# Altium schematic sheet LightLink_V3.SchDoc
size C; SheetNumber: 1; SheetTotal: 7
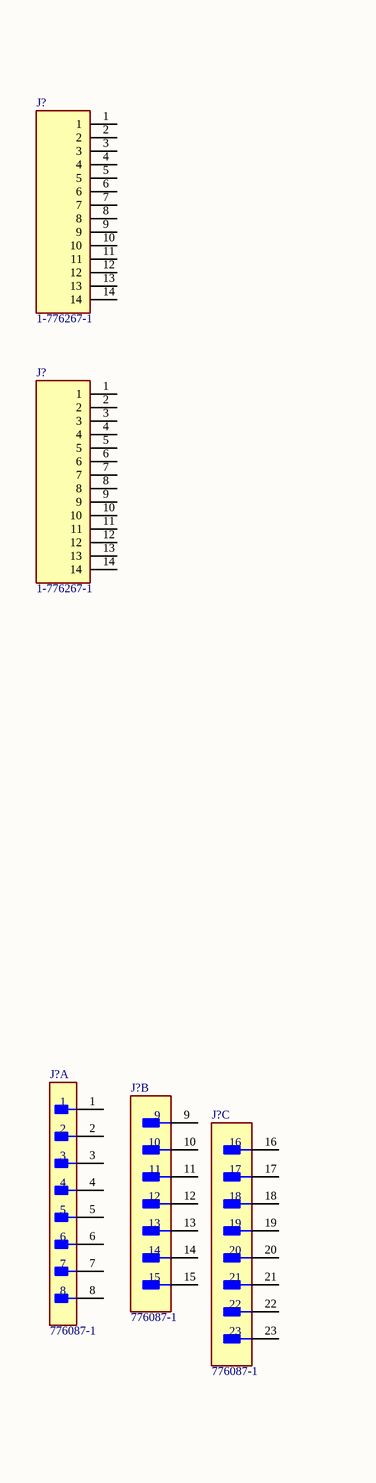
[diagram p0: LightLink_V3.SchDoc, left]
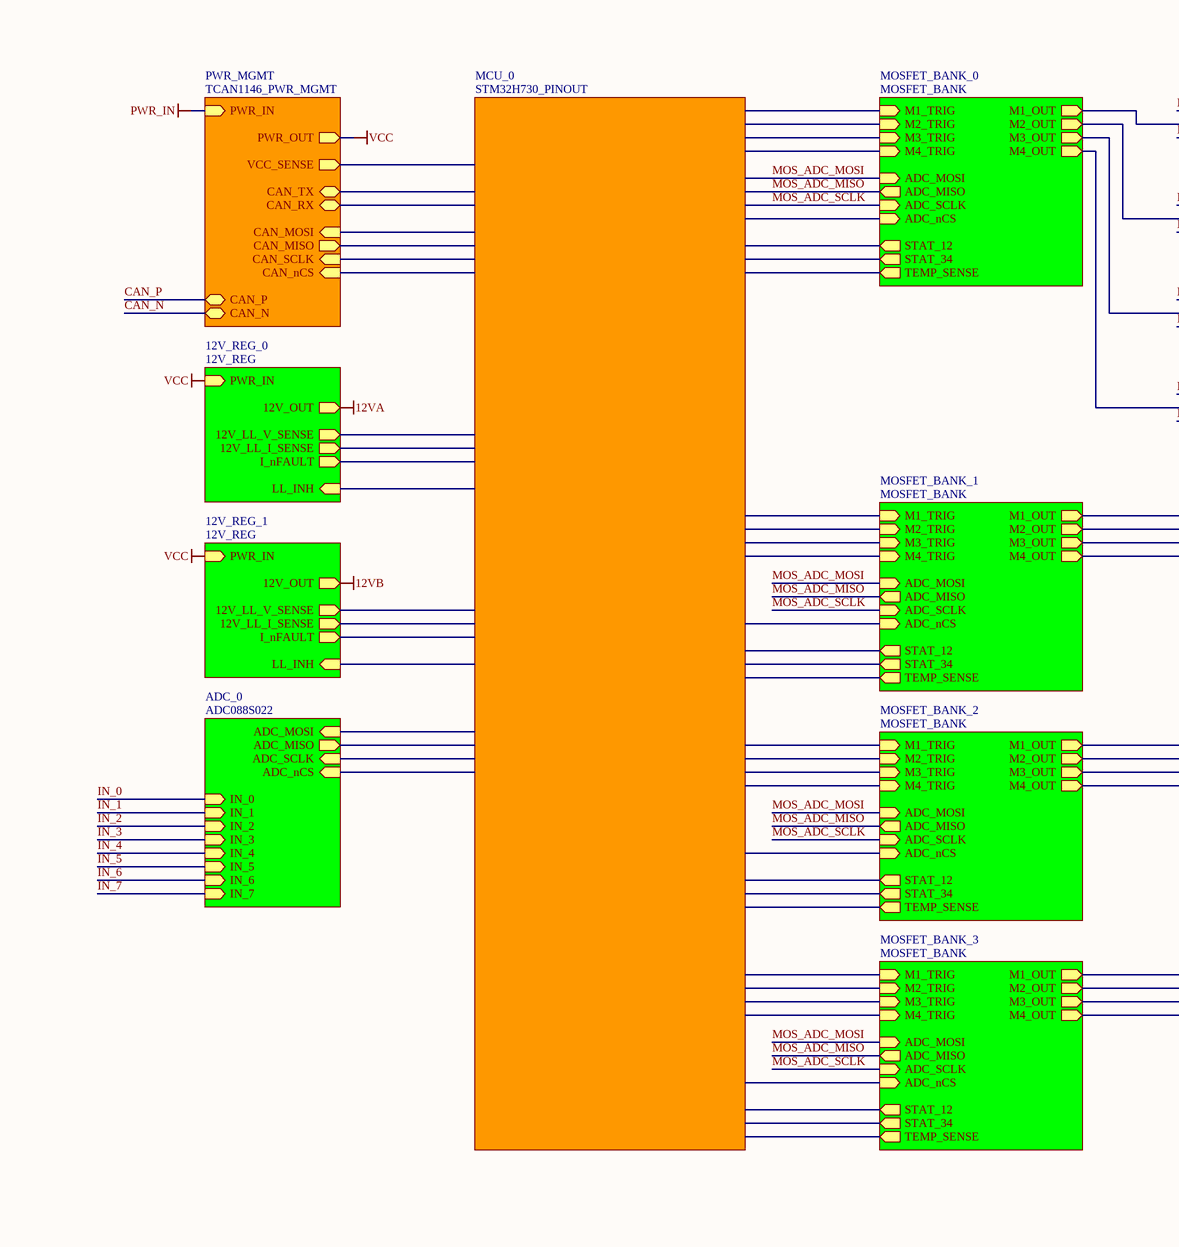
[diagram p1: LightLink_V3.SchDoc, middle]
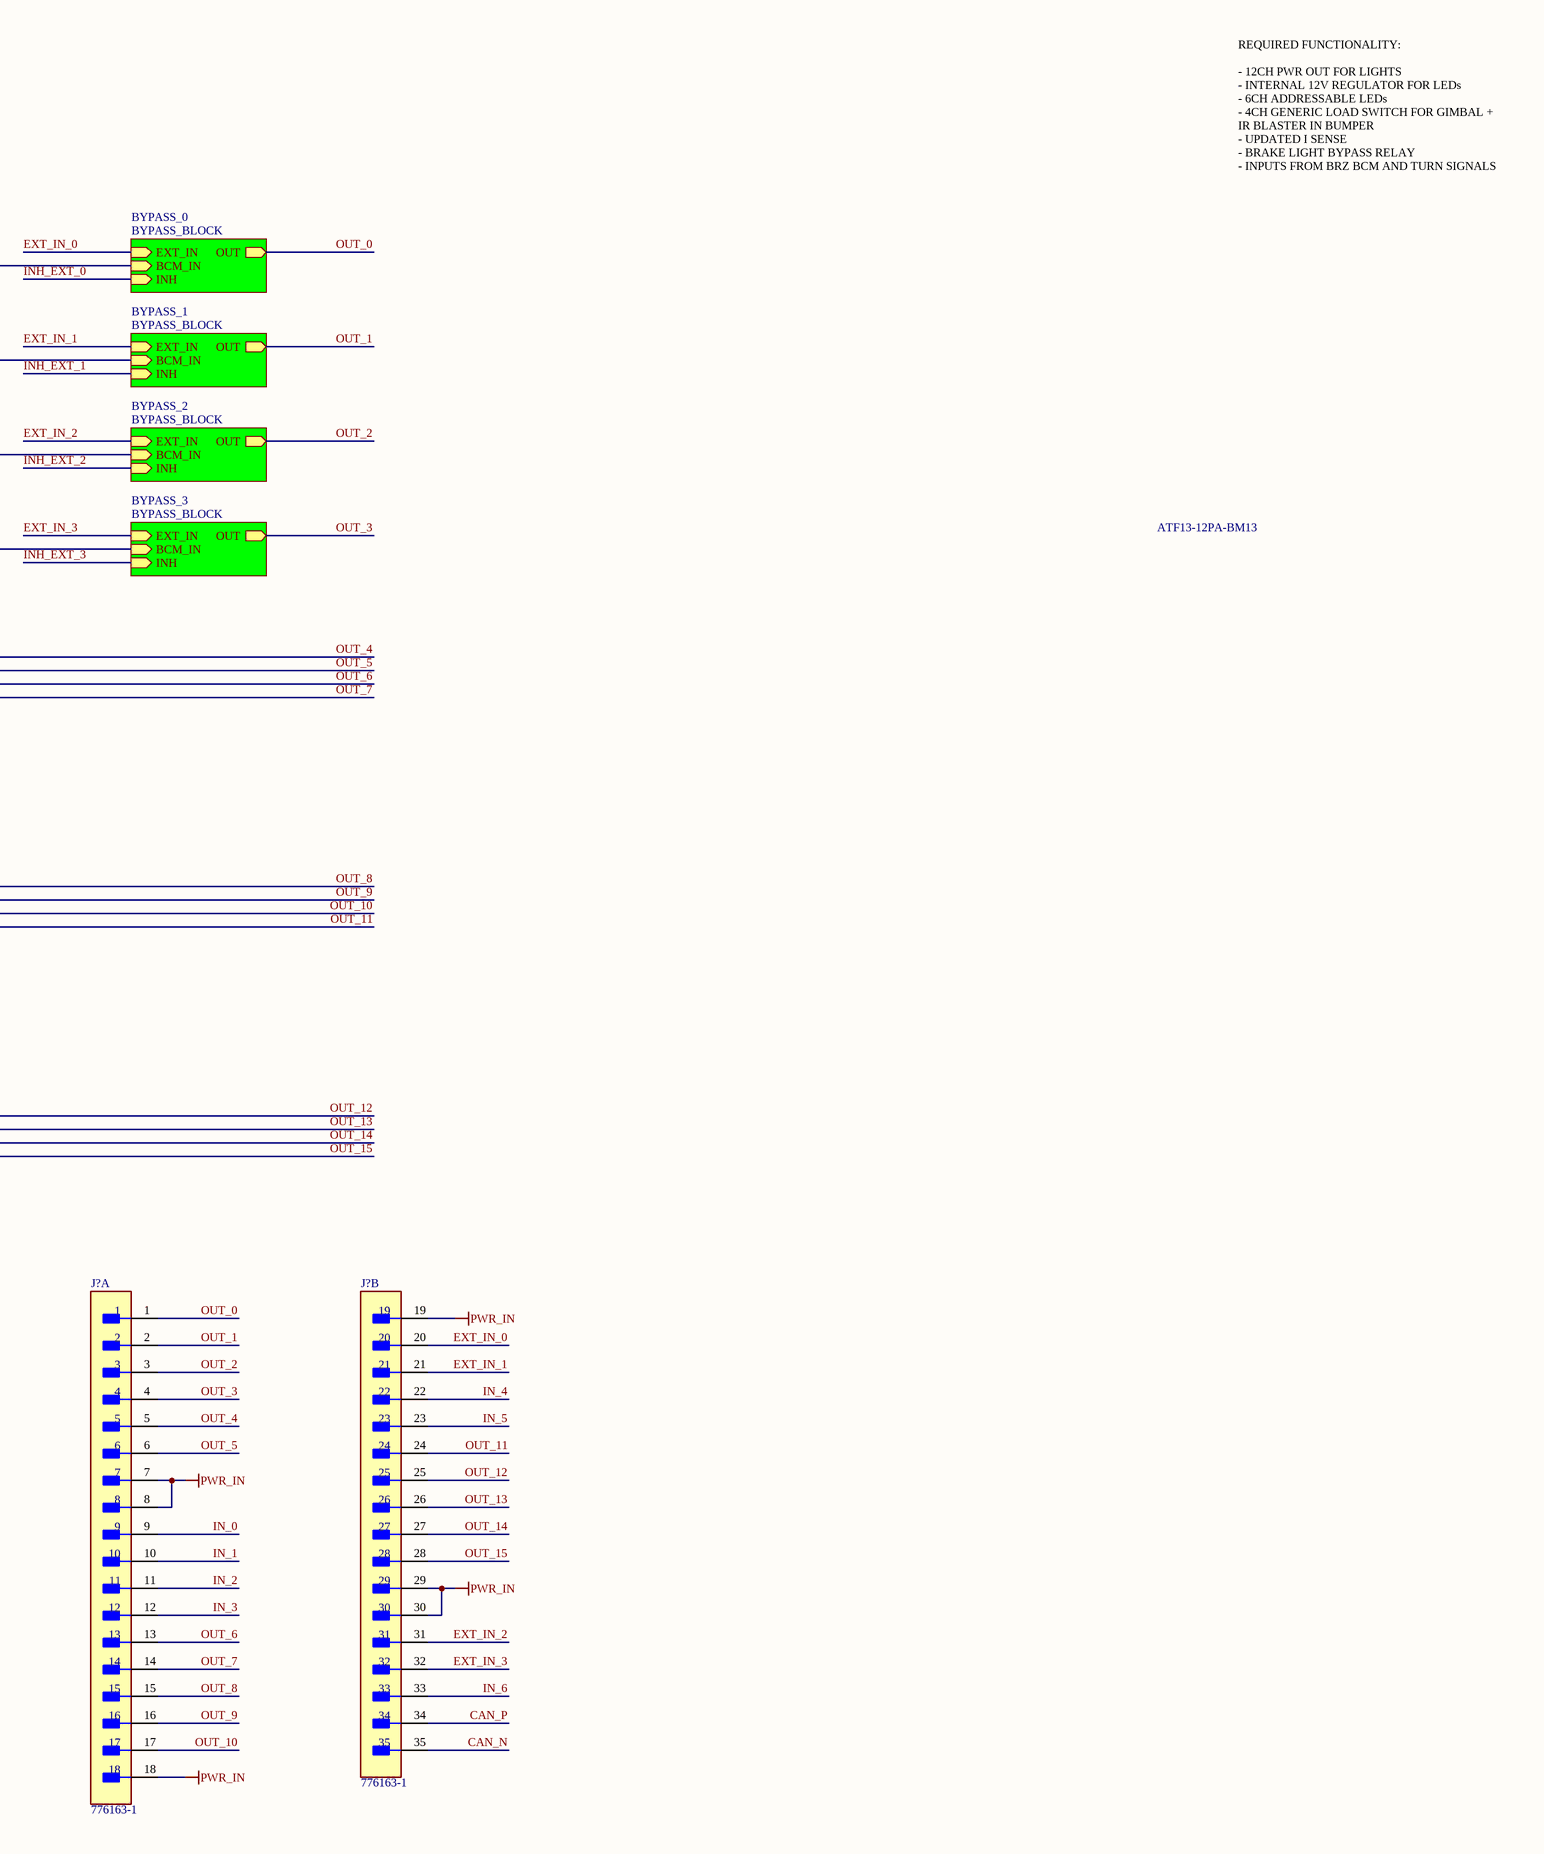
[diagram p2: LightLink_V3.SchDoc, right]

## Parts
(Parts that share a designator on the sheet are numbered #1, #2 ... from top to bottom, then left to right.)
J?#1  1-776267-1  [1-776267-2-Footprint-1]
J?#2  1-776267-1  [1-776267-2-Footprint-1]
J?#3  776163-1  [FP-776163-1-MFG]  (part A of 2)
J?#4  776163-1  [FP-776163-1-MFG]  (part B of 2)
J?#5  776087-1  [FP-776087-1-MFG]  (part A of 3)
J?#6  776087-1  [FP-776087-1-MFG]  (part B of 3)
J?#7  776087-1  [FP-776087-1-MFG]  (part C of 3)

## Sub-sheets
12V_REG_0 = 12V_REG: PWR_IN (in), LL_INH (in), 12V_OUT (out), 12V_LL_V_SENSE (out), 12V_LL_I_SENSE (out), I_nFAULT (out)
12V_REG_1 = 12V_REG: PWR_IN (in), LL_INH (in), 12V_OUT (out), 12V_LL_V_SENSE (out), 12V_LL_I_SENSE (out), I_nFAULT (out)
ADC_0 = ADC088S022: IN_0 (in), IN_1 (in), IN_2 (in), IN_3 (in), IN_4 (in), IN_5 (in), IN_6 (in), IN_7 (in), ADC_MOSI (in), ADC_MISO (out), ADC_SCLK (in), ADC_nCS (in)
BYPASS_0 = BYPASS_BLOCK: EXT_IN (in), OUT (out), INH (in), BCM_IN (in)
BYPASS_1 = BYPASS_BLOCK: EXT_IN (in), OUT (out), INH (in), BCM_IN (in)
BYPASS_2 = BYPASS_BLOCK: EXT_IN (in), OUT (out), INH (in), BCM_IN (in)
BYPASS_3 = BYPASS_BLOCK: EXT_IN (in), OUT (out), INH (in), BCM_IN (in)
MCU_0 = STM32H730_PINOUT: no entries
MOSFET_BANK_0 = MOSFET_BANK: M1_OUT (out), M2_OUT (out), M3_OUT (out), M4_OUT (out), M1_TRIG (in), M2_TRIG (in), M3_TRIG (in), M4_TRIG (in), STAT_12 (out), STAT_34 (out), ADC_MOSI (in), ADC_MISO (out), ADC_SCLK (in), ADC_nCS (in), TEMP_SENSE (out)
MOSFET_BANK_1 = MOSFET_BANK: M1_OUT (out), M2_OUT (out), M3_OUT (out), M4_OUT (out), M1_TRIG (in), M2_TRIG (in), M3_TRIG (in), M4_TRIG (in), STAT_12 (out), STAT_34 (out), ADC_MOSI (in), ADC_MISO (out), ADC_SCLK (in), ADC_nCS (in), TEMP_SENSE (out)
MOSFET_BANK_2 = MOSFET_BANK: M1_OUT (out), M2_OUT (out), M3_OUT (out), M4_OUT (out), M1_TRIG (in), M2_TRIG (in), M3_TRIG (in), M4_TRIG (in), STAT_12 (out), STAT_34 (out), ADC_MOSI (in), ADC_MISO (out), ADC_SCLK (in), ADC_nCS (in), TEMP_SENSE (out)
MOSFET_BANK_3 = MOSFET_BANK: M1_OUT (out), M2_OUT (out), M3_OUT (out), M4_OUT (out), M1_TRIG (in), M2_TRIG (in), M3_TRIG (in), M4_TRIG (in), STAT_12 (out), STAT_34 (out), ADC_MOSI (in), ADC_MISO (out), ADC_SCLK (in), ADC_nCS (in), TEMP_SENSE (out)
PWR_MGMT = TCAN1146_PWR_MGMT: PWR_IN (in), PWR_OUT (out), VCC_SENSE (out), CAN_TX (bidir), CAN_RX (bidir), CAN_SCLK (in), CAN_MISO (out), CAN_MOSI (in), CAN_nCS (in), CAN_P (bidir), CAN_N (bidir)

## Nets
12VA: sheet 12V_REG_0/12V_OUT
12VB: sheet 12V_REG_1/12V_OUT
PWR_IN: J?#3.7 J?#3.8 J?#3.18 J?#4.19 J?#4.29 J?#4.30 ; sheet PWR_MGMT/PWR_IN
VCC: sheet PWR_MGMT/PWR_OUT, sheet 12V_REG_0/PWR_IN, sheet 12V_REG_1/PWR_IN
CAN_N: J?#4.35 ; sheet PWR_MGMT/CAN_N
CAN_P: J?#4.34 ; sheet PWR_MGMT/CAN_P
EXT_IN_0: J?#4.20 ; sheet BYPASS_0/EXT_IN
EXT_IN_1: J?#4.21 ; sheet BYPASS_1/EXT_IN
EXT_IN_2: J?#4.31 ; sheet BYPASS_2/EXT_IN
EXT_IN_3: J?#4.32 ; sheet BYPASS_3/EXT_IN
IN_0: J?#3.9 ; sheet ADC_0/IN_0
IN_1: J?#3.10 ; sheet ADC_0/IN_1
IN_2: J?#3.11 ; sheet ADC_0/IN_2
IN_3: J?#3.12 ; sheet ADC_0/IN_3
IN_4: J?#4.22 ; sheet ADC_0/IN_4
IN_5: J?#4.23 ; sheet ADC_0/IN_5
IN_6: J?#4.33 ; sheet ADC_0/IN_6
IN_7: sheet ADC_0/IN_7
INH_EXT_0: sheet BYPASS_0/INH
INH_EXT_1: sheet BYPASS_1/INH
INH_EXT_2: sheet BYPASS_2/INH
INH_EXT_3: sheet BYPASS_3/INH
MOS_ADC_MISO: sheet MOSFET_BANK_0/ADC_MISO, sheet MOSFET_BANK_1/ADC_MISO, sheet MOSFET_BANK_2/ADC_MISO, sheet MOSFET_BANK_3/ADC_MISO
MOS_ADC_MOSI: sheet MOSFET_BANK_0/ADC_MOSI, sheet MOSFET_BANK_1/ADC_MOSI, sheet MOSFET_BANK_2/ADC_MOSI, sheet MOSFET_BANK_3/ADC_MOSI
MOS_ADC_SCLK: sheet MOSFET_BANK_0/ADC_SCLK, sheet MOSFET_BANK_1/ADC_SCLK, sheet MOSFET_BANK_2/ADC_SCLK, sheet MOSFET_BANK_3/ADC_SCLK
OUT_0: J?#3.1 ; sheet BYPASS_0/OUT
OUT_1: J?#3.2 ; sheet BYPASS_1/OUT
OUT_2: J?#3.3 ; sheet BYPASS_2/OUT
OUT_3: J?#3.4 ; sheet BYPASS_3/OUT
OUT_4: J?#3.5 ; sheet MOSFET_BANK_1/M1_OUT
OUT_5: J?#3.6 ; sheet MOSFET_BANK_1/M2_OUT
OUT_6: J?#3.13 ; sheet MOSFET_BANK_1/M3_OUT
OUT_7: J?#3.14 ; sheet MOSFET_BANK_1/M4_OUT
OUT_8: J?#3.15 ; sheet MOSFET_BANK_2/M1_OUT
OUT_9: J?#3.16 ; sheet MOSFET_BANK_2/M2_OUT
OUT_10: J?#3.17 ; sheet MOSFET_BANK_2/M3_OUT
OUT_11: J?#4.24 ; sheet MOSFET_BANK_2/M4_OUT
OUT_12: J?#4.25 ; sheet MOSFET_BANK_3/M1_OUT
OUT_13: J?#4.26 ; sheet MOSFET_BANK_3/M2_OUT
OUT_14: J?#4.27 ; sheet MOSFET_BANK_3/M3_OUT
OUT_15: J?#4.28 ; sheet MOSFET_BANK_3/M4_OUT
(unnamed): sheet MOSFET_BANK_0/M1_OUT, sheet BYPASS_0/BCM_IN
(unnamed): sheet MOSFET_BANK_0/M2_OUT, sheet BYPASS_1/BCM_IN
(unnamed): sheet MOSFET_BANK_0/M3_OUT, sheet BYPASS_2/BCM_IN
(unnamed): sheet MOSFET_BANK_0/M4_OUT, sheet BYPASS_3/BCM_IN

Not connected (* = marked no-connect by the designer): J?#1 1 2 3 4 5 6 7 8 9 10 11 12 13 14; J?#2 1 2 3 4 5 6 7 8 9 10 11 12 13 14; J?#5 1 2 3 4 5 6 7 8; J?#6 9 10 11 12 13 14 15; J?#7 16 17 18 19 20 21 22 23

## Notes on the sheet
- REQUIRED FUNCTIONALITY:
  - 12CH PWR OUT FOR LIGHTS
  - INTERNAL 12V REGULATOR FOR LEDs
  - 6CH ADDRESSABLE LEDs
  - 4CH GENERIC LOAD SWITCH FOR GIMBAL + IR BLASTER IN BUMPER
  - UPDATED I SENSE
  - BRAKE LIGHT BYPASS RELAY
  - INPUTS FROM BRZ BCM AND TURN SIGNALS
- ATF13-12PA-BM13

## Library data of the parts
J?#1 J?#2 = CMP-002-00075-1: Combination Line Connector, 14 Contact(s), Male, Solder Terminal - MODEL IS CODE2 BUT USE CODE1; RoHS Compliant: Yes; Mounting Technology: Board
J?#3 J?#4 = CMP-03369-000154-1: CONN HEADER R/A 35POS 4MM; Primary Type: Rectangular; Circuit Application: Power; Tab Thickness: 1.3mm; Number of Signal Positions: 35; Shielding: Unshielded; Pitch: 0.157inch; Max Voltage Rating (AC): 250V; Connector System: Wire-to-Device; Insulation: Insulated; Current Rating: 17A; PCB Thickness: 0.062inch; PCB Mount Retention: With; Gender: Male; Connector Type: Male Pin; PCB Mount Alignment: Yes (With); Series: Ampseal; Depth: 37.9mm; Orientation: Right Angle; Length: 3.03inch; Termination: Solder; Radiation Hardening: No; Number of Rows: 3; Contact Plating: Tin; Lead Free: Lead Free; Flammability Rating: UL94 V-0; Contact Material: Brass; Number of Contacts: 35; ELV: Compliant; Max Operating Temperature: 221°C; Min Operating Temperature: -40°C; Package Quantity: 1; Mount: Through Hole; Contact Type: Male Pin; Housing Material: Thermoplastic; Number of Positions: 35; Packaging: Bulk; Row Spacing: 0.157inch; RoHS Compliant: Yes; Height: 32.1mm; Color: Black; Fastening Type: Ramp; Sealable: Yes (With); Width: 37.9mm
J?#5-J?#7 = CMP-03369-000157-2: CONN HEADER R/A 23POS 4MM; Max Voltage Rating (AC): 250V; PCB Thickness: 0.062inch; PCB Mount Alignment: Yes (With); Primary Type: Rectangular; Number of Signal Positions: 23; Row Spacing: 0.157inch; Current Rating: 17A; Connector System: Wire-to-Device; Number of Ports: 1; Shielding: Unshielded; PCB Mount Retention: With; Circuit Application: Power; Tab Thickness: 1.3mm; Gender: Male; Contact Shape: Circular; Mount: Through Hole; ELV: Compliant; Orientation: Right Angle; Lead Free: Lead Free; Contact Plating: Tin; Package Quantity: 1; RoHS Compliant: Yes; Connector Type: Header; Series: Ampseal; Termination: Solder; Voltage Rating (AC): 250V; Contact Material: Brass; Number of Rows: 3; Depth: 37.9mm; Housing Material: Polybutylene; Fastening Type: Ramp; Width: 37.9mm; Flammability Rating: UL94 V-0; Housing Color: Black; Radiation Hardening: No; Contact Type: Male Pin; Sealable: Yes (With); Length: 60.8mm; Max Operating Temperature: 221°C; Packaging: Bulk; Number of Positions: 23; Insulation Material: PBT; Pitch: 0.157inch; Contact Finish - Mating: TIN; Color: Black; Number of Terminals/Pins: 23; Insulation Color: Black; Number of Contacts: 23; Min Operating Temperature: -40°C